# EAGLE schematic Andranik_Tanima_Schematic (EAGLE 7.2.0)
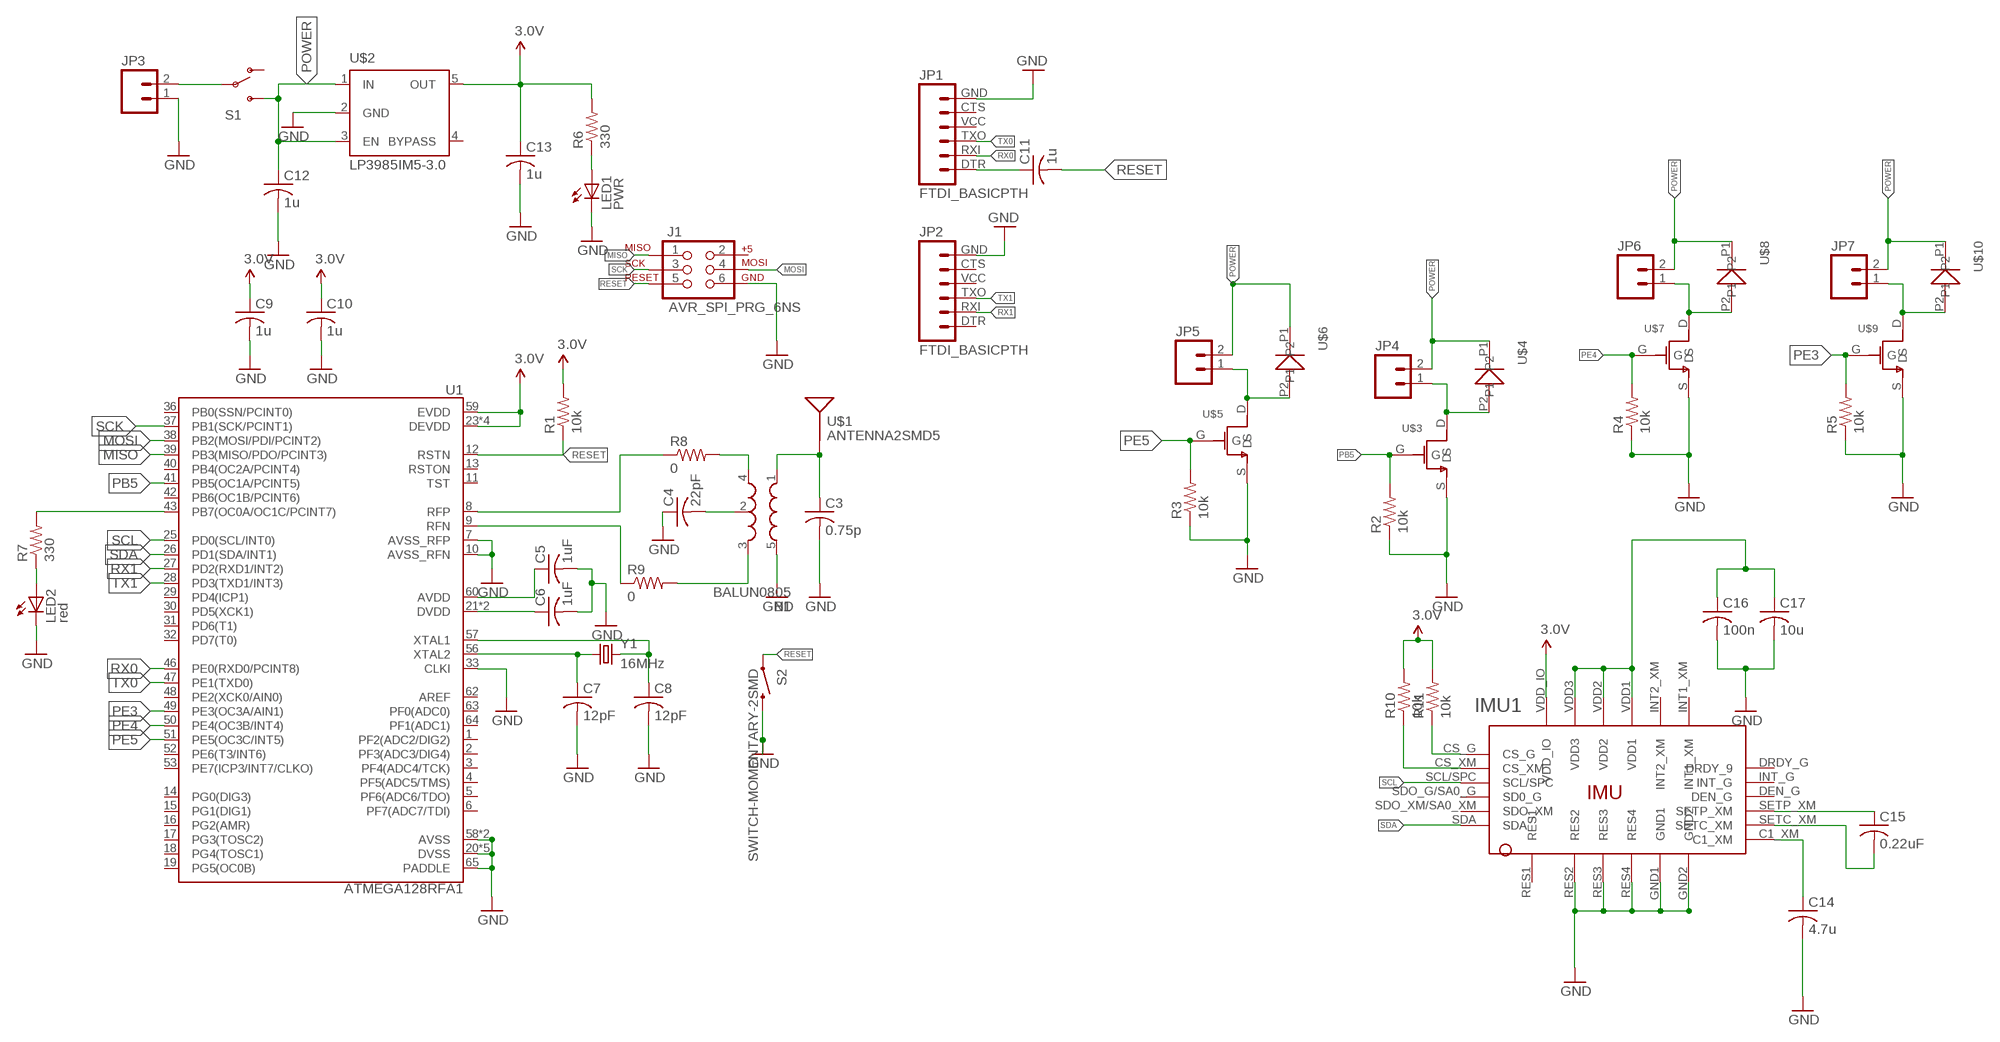
[diagram p0: schematic, sheet 1]

## Parts
B1  BALUN0805  [BALUN]
C3  0.75p  C-USC0805  [C0805]
C4  22pF  C-USC0805  [C0805]
C5  1uF  C-USC0805  [C0805]
C6  1uF  C-USC0805  [C0805]
C7  12pF  C-USC0805  [C0805]
C8  12pF  C-USC0805  [C0805]
C9  1u  C-USC0805  [C0805]
C10  1u  C-USC0805  [C0805]
C11  1u  C-USC0805  [C0805]
C12  1u  C-USC0805  [C0805]
C13  1u  C-USC0805  [C0805]
C14  4.7u  C-USC0805  [C0805]
C15  0.22uF  C-USC0805  [C0805]
C16  100n  C-USC0805  [C0805]
C17  10u  C-USC0805  [C0805]
IMU1  LSM9DS0  [LSM9DS0]
J1  AVR_SPI_PRG_6NS  [2X3-NS]
JP1  FTDI_BASICPTH  [FTDI_BASIC]
JP2  FTDI_BASICPTH  [FTDI_BASIC]
JP3  M02PTH  [1X02]
JP4  M02PTH  [1X02]
JP5  M02PTH  [1X02]
JP6  M02PTH  [1X02]
JP7  M02PTH  [1X02]
LED1  PWR  LEDCHIP-LED0805  [CHIP-LED0805]
LED2  red  LEDCHIP-LED0805  [CHIP-LED0805]
R1  10k  R-US_R0805  [R0805]
R2  10k  R-US_R0805  [R0805]
R3  10k  R-US_R0805  [R0805]
R4  10k  R-US_R0805  [R0805]
R5  10k  R-US_R0805  [R0805]
R6  330  R-US_R0805  [R0805]
R7  330  R-US_R0805  [R0805]
R8  0  R-US_R0805  [R0805]
R9  0  R-US_R0805  [R0805]
R10  10k  R-US_R0805  [R0805]
R11  10k  R-US_R0805  [R0805]
S1  SWITCH-SPDTPTH  [SWITCH-SPDT]
S2  SWITCH-MOMENTARY-2SMD  [TACTILE_SWITCH_SMD]
U1  ATMEGA128RFA1  [QFN-64]
U$1  ANTENNA2SMD5  [ANTENNA-CHIP5]
U$2  LP3985IM5-3.0  [SOT23-DBV]
U$3  SI2302DS_MOSFET  [SI2302DS_MOSFET]
U$4  BAS16WS_DIODE  [BAS16WS_DIODE]
U$5  SI2302DS_MOSFET  [SI2302DS_MOSFET]
U$6  BAS16WS_DIODE  [BAS16WS_DIODE]
U$7  SI2302DS_MOSFET  [SI2302DS_MOSFET]
U$8  BAS16WS_DIODE  [BAS16WS_DIODE]
U$9  SI2302DS_MOSFET  [SI2302DS_MOSFET]
U$10  BAS16WS_DIODE  [BAS16WS_DIODE]
Y1  16MHz  CRYSTAL5X3  [CRYSTAL-SMD-5X3]

## Nets
3.0V: R10.2 R11.2
3.3V: C9.1 C10.1 C13.1 IMU1.VDD_IO R1.2 R6.2 U1.23(DEVDD) U1.34(DEVDD) U1.44(DEVDD) U1.54(DEVDD) U1.59(EVDD) U$2.5(OUT) ; supply symbol labelled 3.0V
CLKI: R9.1 U1.9(RFN)
GND: B1.5(GND) C3.2 C4.1 C5.2 C6.2 C7.2 C8.2 C9.2 C10.2 C12.2 C13.2 C14.2 C16.2 C17.2 IMU1.GND1 IMU1.GND2 IMU1.RES2 IMU1.RES3 IMU1.RES4 J1.6 JP1.GND JP2.GND JP3.1 LED1.C LED2.C R2.1 R3.1 R4.1 R5.1 S2.3 U1.7(AVSS_RFP) U1.10(AVSS_RFN) U1.20(DVSS) U1.24(DVSS) U1.33(CLKI) U1.35(DVSS) U1.45(DVSS) U1.55(DVSS) U1.58(AVSS) U1.61(AVSS) U1.65(PADDLE) U$2.2(GND) U$3.S U$5.S U$7.S U$9.S
MISO: J1.1 U1.39(PB3(MISO/PDO/PCINT3))
MOSI: J1.4 U1.38(PB2(MOSI/PDI/PCINT2))
N$1: B1.4(OUT1) R8.2
N$2: JP5.1 U$5.D U$6.P2
N$3: JP3.2 S1.2(P)
N$4: C5.1 U1.60(AVDD)
N$5: C6.1 U1.21(DVDD) U1.22(DVDD)
N$6: B1.2(GND) C4.2
N$7: B1.3(OUT2) R9.2
N$8: C8.1 U1.57(XTAL1) Y1.3
N$9: B1.1(IN) C3.1 U$1.FEED(SIGNAL)
N$10: LED1.A R6.1
N$11: LED2.A R7.1
N$12: C7.1 U1.56(XTAL2) Y1.1
N$13: R8.1 U1.8(RFP)
N$14: C11.1 JP1.DTR
N$15: IMU1.CS_G R11.1
N$16: IMU1.CS_XM R10.1
N$22: JP4.1 U$3.D U$4.P2
N$23: C14.1 IMU1.C1_XM
N$24: C15.2 IMU1.SETC_XM
N$25: C15.1 IMU1.SETP_XM
N$27: C16.1 C17.1 IMU1.VDD1 IMU1.VDD2 IMU1.VDD3
N$33: JP6.1 U$7.D U$8.P2
N$38: JP7.1 U$9.D U$10.P2
PB5: R2.2 U1.41(PB5(OC1A/PCINT5)) U$3.G
PB7: R7.2 U1.43(PB7(OC0A/OC1C/PCINT7))
PE3: R5.2 U1.49(PE3(OC3A/AIN1)) U$9.G
PE4: R4.2 U1.50(PE4(OC3B/INT4)) U$7.G
PE5: R3.2 U1.51(PE5(OC3C/INT5)) U$5.G
POWER: C12.1 JP4.2 JP5.2 JP6.2 JP7.2 S1.3(S) U$2.1(IN) U$2.3(EN) U$4.P1 U$6.P1 U$8.P1 U$10.P1
RESET: C11.2 J1.5 R1.1 S2.1 U1.12(RSTN)
RX0: JP1.RXI U1.46(PE0(RXD0/PCINT8))
RX1: JP2.RXI U1.27(PD2(RXD1/INT2))
SCK: J1.3 U1.37(PB1(SCK/PCINT1))
SCL: IMU1.SCL/SPC U1.25(PD0(SCL/INT0))
SDA: IMU1.SDA U1.26(PD1(SDA/INT1))
TX0: JP1.TXO U1.47(PE1(TXD0))
TX1: JP2.TXO U1.28(PD3(TXD1/INT3))
Unconnected: IMU1.DEN_G IMU1.DRDY_G(DRDY_9) IMU1.INT1_XM IMU1.INT2_XM IMU1.INT_G IMU1.RES1 IMU1.SDO_G/SA0_G(SD0_G) IMU1.SDO_XM/SA0_XM(SDO_XM) J1.2 JP1.CTS JP1.VCC JP2.CTS JP2.DTR JP2.VCC S1.1(O) U1.1(PF2(ADC2/DIG2)) U1.2(PF3(ADC3/DIG4)) U1.3(PF4(ADC4/TCK)) U1.4(PF5(ADC5/TMS)) U1.5(PF6(ADC6/TDO)) U1.6(PF7(ADC7/TDI)) U1.11(TST) U1.13(RSTON) U1.14(PG0(DIG3)) U1.15(PG1(DIG1)) U1.16(PG2(AMR)) U1.17(PG3(TOSC2)) U1.18(PG4(TOSC1)) U1.19(PG5(OC0B)) U1.29(PD4(ICP1)) U1.30(PD5(XCK1)) U1.31(PD6(T1)) U1.32(PD7(T0)) U1.36(PB0(SSN/PCINT0)) U1.40(PB4(OC2A/PCINT4)) U1.42(PB6(OC1B/PCINT6)) U1.48(PE2(XCK0/AIN0)) U1.52(PE6(T3/INT6)) U1.53(PE7(ICP3/INT7/CLKO)) U1.62(AREF) U1.63(PF0(ADC0)) U1.64(PF1(ADC1)) U$2.4(BYPASS)

## Library data of the parts
B1 = Lab5:BALUN: 0805 footprint balun- Ember 351/357
C3-C17 = Lab5:C-US: CAPACITOR, American symbol
IMU1 = Andranik-Lab4:LSM9DS0; DIST: Digikey; DISTPN: LSM9DS0
J1 = Lab5:AVR_SPI_PRG_6: AVR ISP 6 Pin This is the reduced ISP connector for AVR programming. Common on Arduino. This footprint will take up less PCB space and can be used with a 10-pin to 6-pin adapter such as SKU: BOB-08508
JP1 JP2 = Lab5:FTDI_BASIC: FTDI Basic header with labels
JP3-JP7 = Lab5:M02: Header 2 Standard 2-pin 0.1" header. Use with straight break away headers (SKU : PRT-00116), right angle break away headers (PRT-00553), swiss pins (PRT-00743), machine pins (PRT-00117), and female headers (PRT-00115). Molex polarized connector foot print use with SKU : PRT-08233 with associated crimp pins and housings.
LED1 LED2 = Lab5:LED: LED OSRAM: - CHIPLED LG R971, LG N971, LY N971, LG Q971, LY Q971, LO R971, LY R971 LH N974, LH R974 LS Q976, LO Q976, LY Q976 LO Q996 - Hyper CHIPLED LW Q18S LB Q993, LB Q99A, LB R99A - SideLED LS A670, LO A670, LY A670, LG A670, LP A670 LB A673, LV A673, LT A673, LW A673 LH A674 LY A675 LS A676, LA A676, LO A676, LY A676, LW A676 LS A679, LY A679, LG A679 - Hyper Micro SIDELED® LS Y876, LA Y876, LO Y876, LY Y876 LT Y87S - SmartLED LW L88C, LW L88S LB L89C, LB L89S, LG L890 LS L89K, LO L89K, LY L89K LS L896, LA L896, LO L896, LY L896 - TOPLED LS T670, LO T670, LY T670, LG T670, LP T670 LSG T670, LSP T670, LSY T670, LOP T670, LYG T670 LG T671, LOG T671, LSG T671 LB T673, LV T673, LT T673, LW T673 LH T674 LS T676, LA T676, LO T676, LY T676, LB T676, LH T676, LSB T676, LW T676 LB T67C, LV T67C, LT T67C, LS T67K, LO T67K, LY T67K, LW E67C LS E67B, LA E67B, LO E67B, LY E67B, LB E67C, LV E67C, LT E67C LW T67C LS T679, LY T679, LG T679 LS T770, LO T770, LY T770, LG T770, LP T770 LB T773, LV T773, LT T773, LW T773 LH T774 LS E675, LA E675, LY E675, LS T675 LS T776, LA T776, LO T776, LY T776, LB T776 LHGB T686 LT T68C, LB T68C - Hyper Mini TOPLED® LB M676 - Mini TOPLED Santana® LG M470 LS M47K, LO M47K, LY M47K Source: http://www.osram.convergy.de LUXEON: - LUMILED® LXK2-PW12-R00, LXK2-PW12-S00, LXK2-PW14-U00, LXK2-PW14-V00 LXK2-PM12-R00, LXK2-PM12-S00, LXK2-PM14-U00 LXK2-PE12-Q00, LXK2-PE12-R00, LXK2-PE12-S00, LXK2-PE14-T00, LXK2-PE14-U00 LXK2-PB12-K00, LXK2-PB12-L00, LXK2-PB12-M00, LXK2-PB14-N00, LXK2-PB14-P00, LXK2-PB14-Q00 LXK2-PR12-L00, LXK2-PR12-M00, LXK2-PR14-Q00, LXK2-PR14-R00 LXK2-PD12-Q00, LXK2-PD12-R00, LXK2-PD12-S00 LXK2-PH12-R00, LXK2-PH12-S00 LXK2-PL12-P00, LXK2-PL12-Q00, LXK2-PL12-R00 Source: www.luxeon.com KINGBRIGHT: KA-3528ASYC Source: www.kingbright.com
R1-R11 = Lab5:R-US_: RESISTOR, American symbol
S1 = Lab5:SWITCH-SPDT: SPDT Switch Simple slide switch, Spark Fun Electronics SKU : COM-00102 DPDT SMT slide switch, AYZ0202, SWCH-08179; PROD_ID: SWCH-08261
S2 = Lab5:SWITCH-MOMENTARY-2: Various NO switches- pushbuttons, reed, etc
U1 = Lab5:ATMEGA128RFA1: ATmega128RFA1 8-bit AVR Microcontroller with Low Power 2.4GHz Transceiver for ZigBee and IEEE 802.15.4
U$1 = Lab5:ANTENNA2: Chip antenna Single endded antenna. Common with smaller chip antennas. CHIP4 package is the GPS Chip Antenna SKU: GPS-08418. CHIP5 package is 2.4GHz chip antenna SKU: WRL-00144.
U$2 = Lab5:LP3985IM5-3.0
U$3 U$5 U$7 U$9 = Andranik-Lab4:SI2302DS_MOSFET; DIST: Digikey; DISTPN: Si2302CDS
U$4 U$6 U$8 U$10 = Andranik-Lab4:BAS16WS_DIODE; DIST: VISHAY; DISTPT: BAS16WS
Y1 = Lab5:CRYSTAL: Various standard crystals. Proven footprints. Spark Fun Electronics SKU : COM-00534

## Net classes
0 default: clearance 0.205 mm